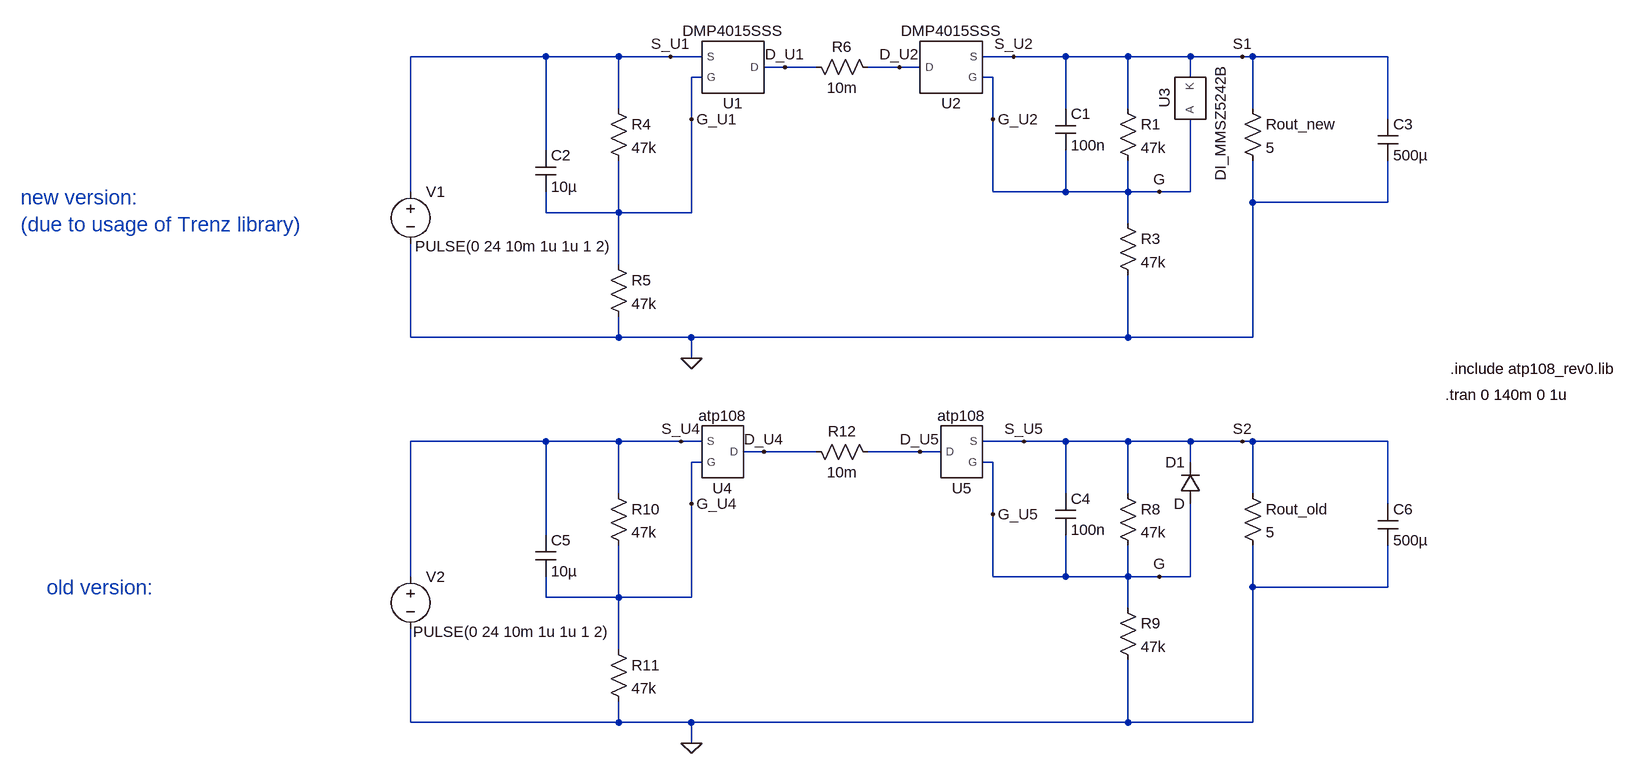
[diagram p0: schematic strombegrenzung_cb_dmp4015sss.asc]
strombegrenzung_cb_dmp4015sss.asc, the LTspice schematic file:
Version 4
SHEET 1 1036 1076
WIRE -640 0 -848 0
WIRE -528 0 -640 0
WIRE -448 0 -528 0
WIRE -400 0 -448 0
WIRE 80 0 32 0
WIRE 160 0 80 0
WIRE 256 0 160 0
WIRE 352 0 256 0
WIRE 432 0 352 0
WIRE 448 0 432 0
WIRE 656 0 448 0
WIRE -272 16 -304 16
WIRE -224 16 -272 16
WIRE -96 16 -144 16
WIRE -64 16 -96 16
WIRE -400 32 -416 32
WIRE 48 32 32 32
WIRE 352 32 352 0
WIRE -528 80 -528 0
WIRE 160 80 160 0
WIRE 256 80 256 0
WIRE 448 80 448 0
WIRE -416 96 -416 32
WIRE 48 96 48 32
WIRE 656 96 656 0
WIRE -640 144 -640 0
WIRE -848 208 -848 0
WIRE 48 208 48 96
WIRE 160 208 160 144
WIRE 160 208 48 208
WIRE 256 208 256 160
WIRE 256 208 160 208
WIRE 304 208 256 208
WIRE 352 208 352 96
WIRE 352 208 304 208
WIRE 448 224 448 160
WIRE 656 224 656 160
WIRE 656 224 448 224
WIRE -640 240 -640 208
WIRE -528 240 -528 160
WIRE -528 240 -640 240
WIRE -416 240 -416 96
WIRE -416 240 -528 240
WIRE 256 256 256 208
WIRE -528 320 -528 240
WIRE -848 432 -848 288
WIRE -528 432 -528 400
WIRE -528 432 -848 432
WIRE -416 432 -528 432
WIRE 256 432 256 336
WIRE 256 432 -416 432
WIRE 448 432 448 224
WIRE 448 432 256 432
WIRE -416 464 -416 432
WIRE -640 592 -848 592
WIRE -528 592 -640 592
WIRE -432 592 -528 592
WIRE -400 592 -432 592
WIRE 96 592 32 592
WIRE 160 592 96 592
WIRE 256 592 160 592
WIRE 352 592 256 592
WIRE 432 592 352 592
WIRE 448 592 432 592
WIRE 656 592 448 592
WIRE -304 608 -336 608
WIRE -224 608 -304 608
WIRE -64 608 -144 608
WIRE -32 608 -64 608
WIRE -400 624 -416 624
WIRE 48 624 32 624
WIRE 352 624 352 592
WIRE -528 672 -528 592
WIRE 160 672 160 592
WIRE 256 672 256 592
WIRE 448 672 448 592
WIRE -416 688 -416 624
WIRE 656 688 656 592
WIRE 48 704 48 624
WIRE -640 736 -640 592
WIRE -848 800 -848 592
WIRE 48 800 48 704
WIRE 160 800 160 736
WIRE 160 800 48 800
WIRE 256 800 256 752
WIRE 256 800 160 800
WIRE 304 800 256 800
WIRE 352 800 352 688
WIRE 352 800 304 800
WIRE 448 816 448 752
WIRE 656 816 656 752
WIRE 656 816 448 816
WIRE -640 832 -640 800
WIRE -528 832 -528 752
WIRE -528 832 -640 832
WIRE -416 832 -416 688
WIRE -416 832 -528 832
WIRE 256 848 256 800
WIRE -528 912 -528 832
WIRE -848 1024 -848 880
WIRE -528 1024 -528 992
WIRE -528 1024 -848 1024
WIRE -416 1024 -528 1024
WIRE 256 1024 256 928
WIRE 256 1024 -416 1024
WIRE 448 1024 448 816
WIRE 448 1024 256 1024
WIRE -416 1056 -416 1024
FLAG 432 0 S1
FLAG 304 208 G
FLAG -416 464 0
FLAG 432 592 S2
FLAG 304 800 G
FLAG -416 1056 0
FLAG -272 16 D_U1
FLAG -448 0 S_U1
FLAG 80 0 S_U2
FLAG -96 16 D_U2
FLAG 48 96 G_U2
FLAG -416 96 G_U1
FLAG -432 592 S_U4
FLAG -304 608 D_U4
FLAG -416 688 G_U4
FLAG -64 608 D_U5
FLAG 96 592 S_U5
FLAG 48 704 G_U5
SYMBOL voltage -848 192 R0
WINDOW 123 0 0 Left 2
WINDOW 39 0 0 Left 2
WINDOW 3 7 100 Left 2
SYMATTR Value PULSE(0 24 10m 1u 1u 1 2)
SYMATTR InstName V1
SYMBOL res 432 64 R0
SYMATTR InstName Rout_new
SYMATTR Value 5
SYMBOL res 240 64 R0
SYMATTR InstName R1
SYMATTR Value 47k
SYMBOL res 240 240 R0
SYMATTR InstName R3
SYMATTR Value 47k
SYMBOL cap 144 80 R0
SYMATTR InstName C1
SYMATTR Value 100n
SYMBOL cap -656 144 R0
SYMATTR InstName C2
SYMATTR Value 10µ
SYMBOL res -544 64 R0
SYMATTR InstName R4
SYMATTR Value 47k
SYMBOL res -544 304 R0
SYMATTR InstName R5
SYMATTR Value 47k
SYMBOL cap 640 96 R0
SYMATTR InstName C3
SYMATTR Value 500µ
SYMBOL res -240 0 M90
WINDOW 0 0 56 VBottom 2
WINDOW 3 32 56 VTop 2
SYMATTR InstName R6
SYMATTR Value 10m
SYMBOL DI_MMSZ5242B 352 64 R270
WINDOW 3 -38 31 Top 2
SYMATTR InstName U3
SYMBOL voltage -848 784 R0
WINDOW 123 0 0 Left 2
WINDOW 39 0 0 Left 2
WINDOW 3 4 101 Left 2
SYMATTR Value PULSE(0 24 10m 1u 1u 1 2)
SYMATTR InstName V2
SYMBOL res 432 656 R0
SYMATTR InstName Rout_old
SYMATTR Value 5
SYMBOL res 240 656 R0
SYMATTR InstName R8
SYMATTR Value 47k
SYMBOL res 240 832 R0
SYMATTR InstName R9
SYMATTR Value 47k
SYMBOL cap 144 672 R0
SYMATTR InstName C4
SYMATTR Value 100n
SYMBOL cap -656 736 R0
SYMATTR InstName C5
SYMATTR Value 10µ
SYMBOL res -544 656 R0
SYMATTR InstName R10
SYMATTR Value 47k
SYMBOL res -544 896 R0
SYMATTR InstName R11
SYMATTR Value 47k
SYMBOL cap 640 688 R0
SYMATTR InstName C6
SYMATTR Value 500µ
SYMBOL res -240 592 M90
WINDOW 0 0 56 VBottom 2
WINDOW 3 32 56 VTop 2
SYMATTR InstName R12
SYMATTR Value 10m
SYMBOL diode 368 688 R180
WINDOW 0 24 64 Left 2
WINDOW 3 24 0 Left 2
SYMATTR InstName D1
SYMBOL DMP4015SSS -352 16 R180
SYMATTR InstName U1
SYMBOL DMP4015SSS -16 16 M180
SYMATTR InstName U2
SYMBOL atp108 -368 608 R180
SYMATTR InstName U4
SYMBOL atp108 0 608 M180
SYMATTR InstName U5
TEXT 744 520 Left 2 !.tran 0 140m 0 1u
TEXT 752 480 Left 2 !.include atp108_rev0.lib
TEXT -1448 216 Left 3 ;new version: \n(due to usage of Trenz library)
TEXT -1408 816 Left 3 ;old version:

The netlist it stands for:
* strombegrenzung_cb_dmp4015sss.asc
V1 S_U1 0 PULSE(0 24 10m 1u 1u 1 2)
Rout_new S_U2 0 5
R1 S_U2 G_U5 47k
R3 G_U5 0 47k
C1 S_U2 G_U5 100n
C2 S_U1 G_U1 10µ
R4 S_U1 G_U1 47k
R5 G_U1 0 47k
C3 S_U2 0 500µ
R6 D_U1 D_U2 10m
XU3 G_U5 S_U2 DI_MMSZ5242B  ; pins A K
V2 S_U4 0 PULSE(0 24 10m 1u 1u 1 2)
Rout_old S_U5 0 5
R8 S_U5 G_U5 47k
R9 G_U5 0 47k
C4 S_U5 G_U5 100n
C5 S_U4 G_U4 10µ
R10 S_U4 G_U4 47k
R11 G_U4 0 47k
C6 S_U5 0 500µ
R12 D_U4 D_U5 10m
D1 G_U5 S_U5 D
XU1 D_U1 G_U1 S_U1 DMP4015SSS  ; pins D G S
XU2 D_U2 G_U5 S_U2 DMP4015SSS  ; pins D G S
XU4 D_U4 G_U4 S_U4 atp108  ; pins D G S
XU5 D_U5 G_U5 S_U5 atp108  ; pins D G S
.model D D
.lib standard.dio
.tran 0 140m 0 1u
.include atp108_rev0.lib
* new version:
* (due to usage of Trenz library)
* old version:
.lib MMSZ5242B.spice.txt
.lib DMP4015SSS.spice.txt
.lib atp108_rev0.lib
.backanno
.end